# Altium project mc60_programmer.PrjPcb
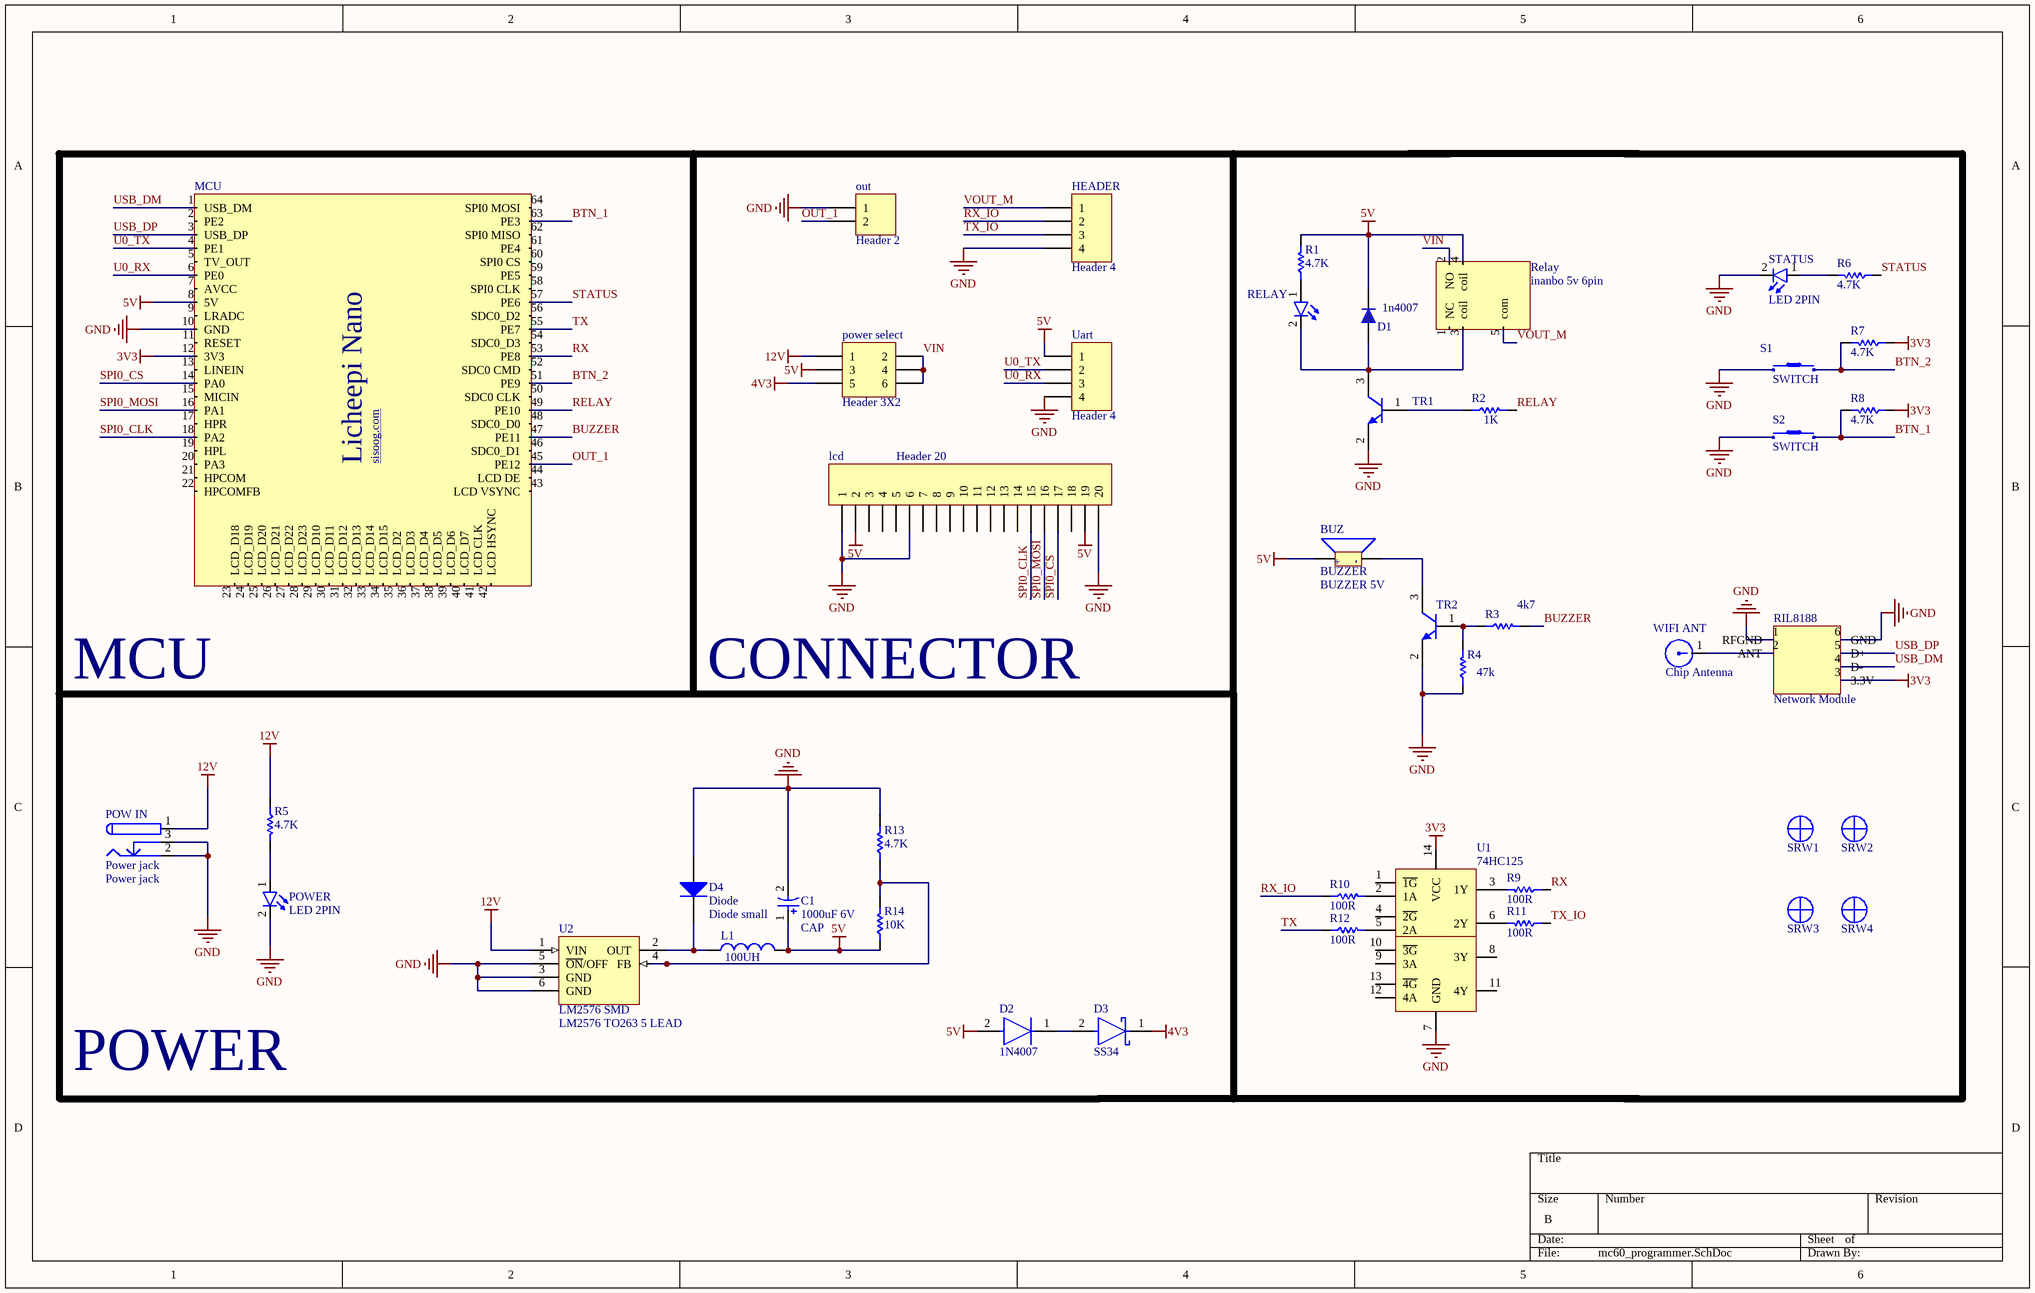
[diagram p0: mc60_programmer.SchDoc]
1 sheet, 44 parts. Net scope: global (net labels, ports and power ports of the same name join across sheets).
Board file: mc60_programmer.PcbDoc

## Sheet mc60_programmer.SchDoc
size B; SheetNumber: 1; SheetTotal: 1

### Parts
(Parts that share a designator on the sheet are numbered #1, #2 ... from top to bottom, then left to right.)
BUZ  BUZZER  [BUZZER]
C1  1000uF 6V  [ALUMINUM "CAP"]
D1  1n4007  [DIOM4629X24N]
D2  1N4007  [FP-SMA-MFG]
D3  SS34  [FP-SMA-MFG]
D4  Diode  [DIODE DO-214AC SMD]
HEADER  Header 4  [HDR1X4]
L1  100UH  [INDOCTUR]
lcd  Header 20  [HDR1X20]
MCU  licheepi_nano  [licheepi_nano]  (value not drawn)
out  Header 2  [HDR1X2]
POW_IN  Power jack  [Power Jack]
POWER  LED 2PIN  [LED 0805]
power_select  Header 3X2  [HDR2X3]
R1  4.7K  [0805_1/8W]
R2  1K  [0805_1/8W]
R3  4k7  [0805_1/8W]
R4  47k  [0805_1/8W]
R5  4.7K  [0805_1/8W]
R6  4.7K  [0805_1/8W]
R7  4.7K  [0805_1/8W]
R8  4.7K  [0805_1/8W]
R9  100R  [0805_1/8W]
R10  100R  [0805_1/8W]
R11  100R  [0805_1/8W]
R12  100R  [0805_1/8W]
R13  4.7K  [0805_1/8W]
R14  10K  [0805_1/8W]
RELAY#1  LED 2PIN  [LED 0805]  (value not drawn)
Relay#2  inanbo 5v 6pin  [relay]
RIL8188  Network Module  [ril8188]
S1  SWITCH  [push button]
S2  SWITCH  [push button]
SRW1  Screw  [Board Screw]  (value not drawn)
SRW2  Screw  [Board Screw]  (value not drawn)
SRW3  Screw  [Board Screw]  (value not drawn)
SRW4  Screw  [Board Screw]  (value not drawn)
STATUS  LED 2PIN  [LED 0805]
TR1  NPN SMD  [Transistore npn]  (value not drawn)
TR2  NPN SMD  [Transistore npn]  (value not drawn)
U1  74HC125  [DIP14 7.62mm]
U2  LM2576 SMD  [TO-263 5 LEAD]
Uart  Header 4  [HDR1X4]
WIFI_ANT  Chip Antenna  [2.4GHz Antenna]

### Nets
3V3: MCU.12(3V3) R7.1 R8.1 RIL8188.3(3.3V) U1.14(VCC)
4V3: D3.1(K) power_select.5
5V: BUZ.1(+) C1.1 D1.2 D2.2(A) L1.2 lcd.2 lcd.19 MCU.8(5V) power_select.3 R1.2 R14.1 Relay#2.4(coil) Uart.1
12V: POW_IN.1 power_select.1 R5.1 U2.1(VIN)
GND: C1.2 D4.1(A) HEADER.4 lcd.1 lcd.6 lcd.20 MCU.10(GND) out.1 POW_IN.2 POW_IN.3 POWER.2(K) R4.1 R13.2 RIL8188.1(RFGND) RIL8188.6(GND) S1.1 S2.1 STATUS.2(K) TR1.2(E) TR2.2(E) U1.7(GND) U2.3(GND) U2.5(~{ON}/OFF) U2.6(GND) Uart.4
BTN_1: MCU.63(PE3) R8.2 S2.2
BTN_2: MCU.51(PE9) R7.2 S1.2
BUZZER: MCU.47(PE11) R3.2
OUT_1: MCU.45(PE12) out.2
RELAY: MCU.49(PE10) R2.2
RX: MCU.53(PE8) R9.1
RX_IO: HEADER.2 R10.1
SPI0_CLK: lcd.15 MCU.18(PA2)
SPI0_CS: lcd.17 MCU.14(PA0)
SPI0_MOSI: lcd.16 MCU.16(PA1)
STATUS: MCU.57(PE6) R6.1
TX: MCU.55(PE7) R12.1
TX_IO: HEADER.3 R11.1
U0_RX: MCU.6(PE0) Uart.3
U0_TX: MCU.4(PE1) Uart.2
USB_DM: MCU.1(USB_DM) RIL8188.4(D-)
USB_DP: MCU.3(USB_DP) RIL8188.5(D+)
VIN: power_select.2 power_select.4 power_select.6 Relay#2.2(NO)
VOUT_M: HEADER.1 Relay#2.5(com)
NetBUZ_2: BUZ.2(-) TR2.3(C)
NetD1_1: D1.1 RELAY#1.2(K) Relay#2.3(coil) TR1.3(C)
NetD2_1: D2.1(C) D3.2(A)
NetD4_2: D4.2(K) L1.1 U2.2(OUT)
NetPOWER_1: POWER.1(A) R5.2
NetR1_1: R1.1 RELAY#1.1(A)
NetR2_1: R2.1 TR1.1(B)
NetR3_1: R3.1 R4.2 TR2.1(B)
NetR6_2: R6.2 STATUS.1(A)
NetR9_2: R9.2 U1.3(1Y)
NetR10_2: R10.2 U1.2(1A)
NetR11_2: R11.2 U1.6(2Y)
NetR12_2: R12.2 U1.5(2A)
NetR13_1: R13.1 R14.2 U2.4(FB)
NetRIL8188_2: RIL8188.2(ANT) WIFI_ANT.1

Not connected (* = marked no-connect by the designer): lcd 3 4 5 7 8 9 10 11 12 13 14 18; MCU 2(PE2) 5(TV_OUT) 7(AVCC) 9(LRADC) 11(RESET) 13(LINEIN) 15(MICIN) 17(HPR) 19(HPL) 20(PA3) 21(HPCOM) 22(HPCOMFB) 23(LCD_D18) 24(LCD_D19) 25(LCD_D20) 26(LCD_D21) 27(LCD_D22) 28(LCD_D23) 29(LCD_D10) 30(LCD_D11) 31(LCD_D12) 32(LCD_D13) 33(LCD_D14) 34(LCD_D15) 35(LCD_D2) 36(LCD_D3) 37(LCD_D4) 38(LCD_D5) 39(LCD_D6) 40(LCD_D7) 41(LCD_CLK) 42(LCD_HSYNC) 43(LCD_VSYNC) 44(LCD_DE) 46(SDC0_D1) 48(SDC0_D0) 50(SDC0_CLK) 52(SDC0_CMD) 54(SDC0_D3) 56(SDC0_D2) 58(SPI0_CLK) 59(PE5) 60(SPI0_CS) 61(PE4) 62(SPI0_MISO) 64(SPI0_MOSI); Relay#2 1(NC); U1 1(~{1G}) 4(~{2G}) 8(3Y) 9(3A) 10(~{3G}) 11(4Y) 12(4A) 13(~{4G})

### Notes on the sheet
- MCU
- CONNECTOR
- POWER
- (in symbol BUZZER) BUZZER 5V
- (in symbol Diode) Diode small
- (in symbol licheepi_nano) Licheepi Nano; sisoog.com
- (in symbol LM2576 SMD) LM2576 TO263 5 LEAD

### Library data of the parts
C1 = CAP
D1 = 1n4007 SMD M7: Standard Rectifiers; Part. No: M7; Manufacturer: DC COMPONENTS; Designer: Abbas Basereh; Link: http://www.tme.eu/en/details/m7/smd-universal-diodes/dc-components/; Link: https://www.aliexpress.com/item/Smd-tube-1n4007-m7-SMA/1213719741.html?spm=2114.01010208.3.1.ZyZ7bC&ws_ab_test=searchweb0_0,searchweb201602_4_10065_10068_10084_10083_10080_10082_10081_10060_10061_10062_10056_10055_10054_10059_10099_10078_10079_427_10073_10103_10102_10096_10052_10050_10051,searchweb201603_4&btsid=db2be5ca-e560-400a-b91c-484ab5ee228b; Data: 16-12-2016
D2 = CMP-12828-000004-1: TVS DIODE 15V 24.4V SMA; Manufacturer: Diodes Inc; Manufacturer Part Number: SMAJ15A-13-F; Max Junction Temp: +150°C; Direction: Unidirectional; Peak Pulse Current: 16.4A; Peak Pulse Power: 400W; Standoff Height: 0.05mm; Breakdown Voltage: 16.7V; Number Of Channels: 1; Automotive: No; Device Class L2: TVS Diodes; Clamping Voltage: 24.4V; Temperature Range Low: -55°C; ComponentLink2URL: https://www.diodes.com/assets/Datasheets/ds19005.pdf; ComponentLink2Description: Datasheet; Temperature Range High: +150°C; Mouser Description: TVS DIODE 15V 24.4V SMA; Package: SMA; Reverse Standoff Voltage: 15V; Device Class L1: Circuit Protection; Device Class L3: unset; Footprint Url: https://www.diodes.com/assets/Package-Files/SMA.pdf; Category: Diode; Octopart: https://octopart.com/smaj15a-13-f-diodes+inc.-349875; RoHS: TRUE; Temperature: -55°C to +150°C; Lead Free: Yes; Digikey Description: TVS DIODE 15V 24.4V SMA; Height: 2.4mm
D3 = CMP-12187-000020-1: DIODE SCHOTTKY 40V 1A SMA; Manufacturer Part Number: STPS140A; Manufacturer: STMicroelectronics; Standoff Height: 0.05mm; Peak Reverse Current: 12uA; Max Junction Temp: +150°C; Max Surge Forward Current: 60A; Max Repetitive Reverse Voltage: 40V; Temperature: to +150°C; RoHS: TRUE; Package: SMA; Octopart: https://octopart.com/stps140a-stmicroelectronics-324279; Automotive: No; Height: 2.65mm; ComponentLink2Description: Datasheet; Mouser Description: Schottky Diodes & Rectifiers 1.0 Amp 40 Volt; Device Class L1: Discrete Semiconductors; Lead Free: Yes; Device Class L3: Schottky Diodes; Device Class L2: Diodes; Temperature Range High: +150°C; ComponentLink2URL: https://www.st.com/content/ccc/resource/technical/document/datasheet/64/e3/d7/a9/4a/d4/48/35/CD00001107.pdf/files/CD00001107.pdf/jcr:content/translations/en.CD00001107.pdf; Digikey Description: DIODE SCHOTTKY 40V 1A SMA; Forward Current: 1A; Category: Diode
HEADER Uart = Header 4: Header, 4-Pin; LatestRevisionDate: 17-Jul-2002; LatestRevisionNote: Re-released for DXP Platform.; Publisher: Altium Limited
L1 = Inductor
lcd = Header 20: Header, 20-Pin; LatestRevisionDate: 17-Jul-2002; LatestRevisionNote: Re-released for DXP Platform.; Publisher: Altium Limited
out = Header 2: Header, 2-Pin; LatestRevisionDate: 17-Jul-2002; LatestRevisionNote: Re-released for DXP Platform.; Publisher: Altium Limited
power_select = Header 3X2: Header, 3-Pin, Dual row; LatestRevisionDate: 17-Jul-2002; LatestRevisionNote: Re-released for DXP Platform.; Publisher: Altium Limited
R1-R14 = RESISTOR
Relay#2 = relay
RIL8188 = RIL8188
SRW1-SRW4 = Board Screw 3MM: Board Screw With Spacer